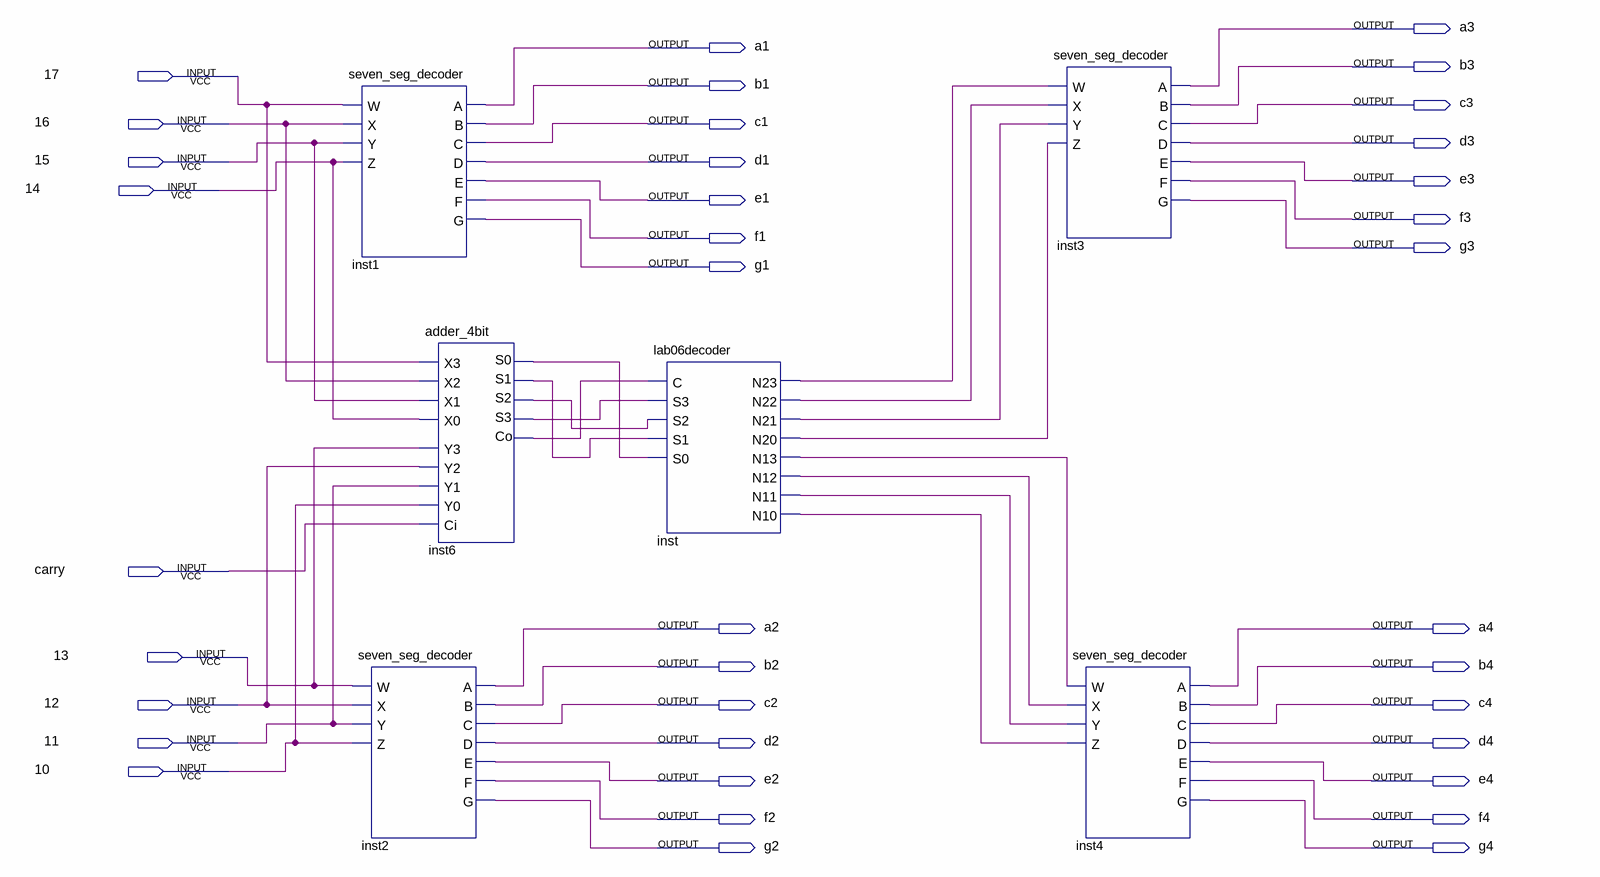
[diagram p0: schematic sheet]
// Quartus schematic lab06.bdf as structural Verilog: 6 symbols, 37 pins
module lab06 (
  input  \17 ,
  input  \16 ,
  input  \15 ,
  input  \14 ,
  input  carry,
  input  \13 ,
  input  \12 ,
  input  \11 ,
  input  \10 ,
  output a3,
  output a1,
  output b3,
  output b1,
  output c3,
  output c1,
  output d3,
  output d1,
  output e3,
  output e1,
  output f3,
  output f1,
  output g3,
  output g1,
  output a2,
  output a4,
  output b2,
  output b4,
  output c2,
  output c4,
  output d2,
  output d4,
  output e2,
  output e4,
  output f2,
  output f4,
  output g2,
  output g4
);

  wire inst6_co, inst6_s0, inst6_s1, inst6_s2, inst6_s3, inst_n10, inst_n11, inst_n12, inst_n13, inst_n20,
       inst_n21, inst_n22, inst_n23;

  seven_seg_decoder inst1 (
    .W(\17 ), .X(\16 ), .Y(\15 ), .Z(\14 ), .A(a1), .B(b1), .C(c1), .D(d1), .E(e1), .F(f1), .G(g1));
  seven_seg_decoder inst2 (
    .W(\13 ), .X(\12 ), .Y(\11 ), .Z(\10 ), .A(a2), .B(b2), .C(c2), .D(d2), .E(e2), .F(f2), .G(g2));
  adder_4bit inst6 (
    .X3(\17 ), .Y3(\13 ), .X2(\16 ), .Y2(\12 ), .X1(\15 ), .Y1(\11 ), .X0(\14 ), .Y0(\10 ), .Ci(carry),
    .S0(inst6_s0), .S1(inst6_s1), .S2(inst6_s2), .S3(inst6_s3), .Co(inst6_co));
  lab06decoder inst (
    .C(inst6_co), .S3(inst6_s3), .S2(inst6_s2), .S1(inst6_s1), .S0(inst6_s0), .N23(inst_n23), .N22(inst_n22),
    .N21(inst_n21), .N20(inst_n20), .N13(inst_n13), .N12(inst_n12), .N11(inst_n11), .N10(inst_n10));
  seven_seg_decoder inst3 (
    .W(inst_n23), .X(inst_n22), .Y(inst_n21), .Z(inst_n20), .A(a3), .B(b3), .C(c3), .D(d3), .E(e3), .F(f3),
    .G(g3));
  seven_seg_decoder inst4 (
    .W(inst_n13), .X(inst_n12), .Y(inst_n11), .Z(inst_n10), .A(a4), .B(b4), .C(c4), .D(d4), .E(e4), .F(f4),
    .G(g4));
endmodule
